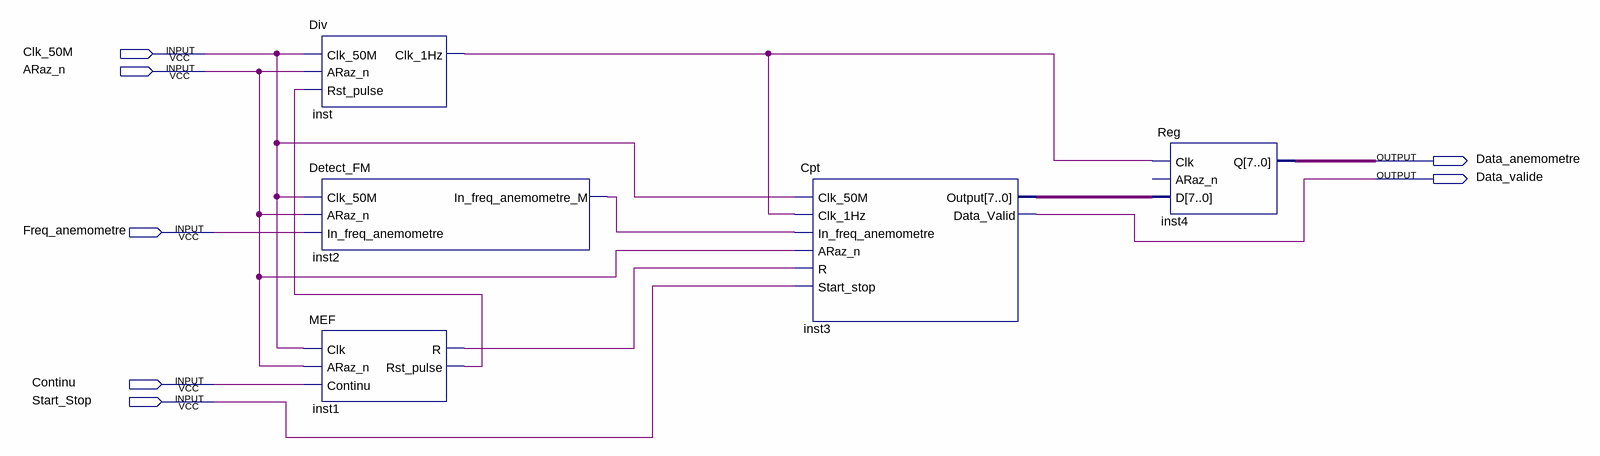
[diagram p0: schematic sheet]
// Quartus schematic F1_1_validé.bdf as structural Verilog: 5 symbols, 7 pins
module \F1_1_validé  (
  input  Clk_50M,
  input  ARaz_n,
  input  Freq_anemometre,
  input  Continu,
  input  Start_Stop,
  output Data_anemometre,
  output Data_valide
);

  wire inst1_r, inst1_rst_pulse, inst2_in_freq_anemometre_m, inst_clk_1hz;
  wire [7:0] inst3_output, inst4_q;

  Div inst (.Clk_50M(Clk_50M), .ARaz_n(ARaz_n), .Rst_pulse(inst1_rst_pulse), .Clk_1Hz(inst_clk_1hz));
  Detect_FM inst2 (
    .Clk_50M(Clk_50M), .ARaz_n(ARaz_n), .In_freq_anemometre(Freq_anemometre),
    .In_freq_anemometre_M(inst2_in_freq_anemometre_m));
  MEF inst1 (.Clk(Clk_50M), .ARaz_n(ARaz_n), .Continu(Continu), .R(inst1_r), .Rst_pulse(inst1_rst_pulse));
  Cpt inst3 (
    .Clk_50M(Clk_50M), .Clk_1Hz(inst_clk_1hz), .In_freq_anemometre(inst2_in_freq_anemometre_m),
    .ARaz_n(ARaz_n), .R(inst1_r), .Start_stop(Start_Stop), .Output(inst3_output), .Data_Valid(Data_valide));
  Reg inst4 (.Clk(inst_clk_1hz), .D(inst3_output), .Q(inst4_q));  // open: ARaz_n
endmodule
